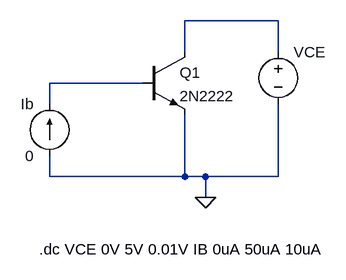
[diagram p0: schematic 1.1.1.asc]
1.1.1.asc, the LTspice schematic file:
Version 4
SHEET 1 880 680
WIRE 320 16 176 16
WIRE 176 64 176 16
WIRE 320 64 320 16
WIRE 112 112 -32 112
WIRE -32 144 -32 112
WIRE -32 256 -32 224
WIRE 176 256 176 160
WIRE 176 256 -32 256
WIRE 208 256 176 256
WIRE 320 256 320 144
WIRE 320 256 208 256
WIRE 208 288 208 256
FLAG 208 288 0
SYMBOL voltage 320 48 R0
SYMATTR InstName VCE
SYMATTR Value ""
SYMBOL npn 112 64 R0
SYMATTR InstName Q1
SYMATTR Value 2N2222
SYMBOL current -32 224 R180
WINDOW 0 24 80 Left 2
WINDOW 3 24 0 Left 2
WINDOW 123 0 0 Left 0
WINDOW 39 0 0 Left 0
SYMATTR InstName Ib
SYMATTR Value 0
TEXT -48 368 Left 2 !.dc VCE 0V 5V 0.01V IB 0uA 50uA 10uA

The netlist it stands for:
* 1.1.1.asc
VCE N001 0
Q1 N001 N002 0 0 2N2222
Ib 0 N002 0
.model NPN NPN
.model PNP PNP
.lib standard.bjt
.dc VCE 0V 5V 0.01V IB 0uA 50uA 10uA
.backanno
.end